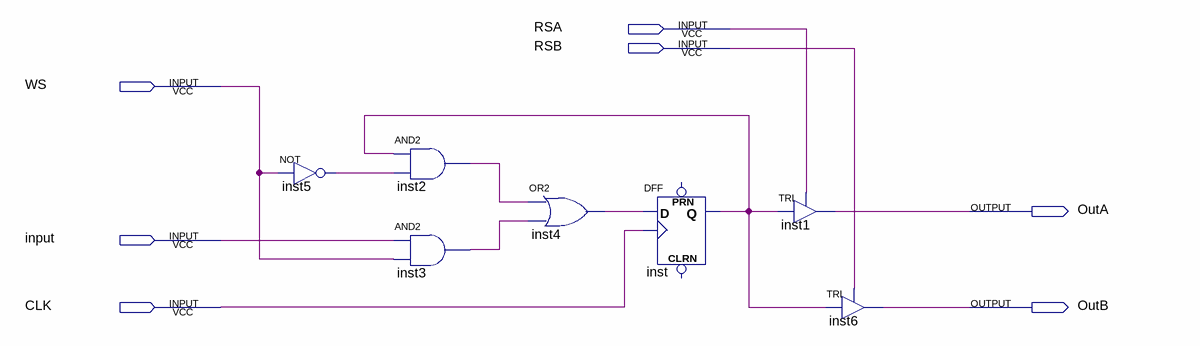
[diagram p0: schematic sheet]
// Quartus schematic RFC.bdf as structural Verilog: 7 symbols, 7 pins
module RFC (
  input  RSA,
  input  RSB,
  input  WS,
  input  \input ,
  input  CLK,
  output OutA,
  output OutB
);

  wire inst2_out, inst3_out, inst4_out, inst5_out, inst_q;

  not inst5 (inst5_out, WS);
  and inst2 (inst2_out, inst_q, inst5_out);
  and inst3 (inst3_out, \input , WS);
  or inst4 (inst4_out, inst2_out, inst3_out);
  DFF inst (.CLK(CLK), .D(inst4_out), .Q(inst_q));  // open: CLRN, PRN
  TRI inst1 (.IN(inst_q), .OE(RSA), .OUT(OutA));
  TRI inst6 (.IN(inst_q), .OE(RSB), .OUT(OutB));
endmodule
